# EAGLE design Blinky Buildings - Empire State Building (EAGLE 6.6.0)
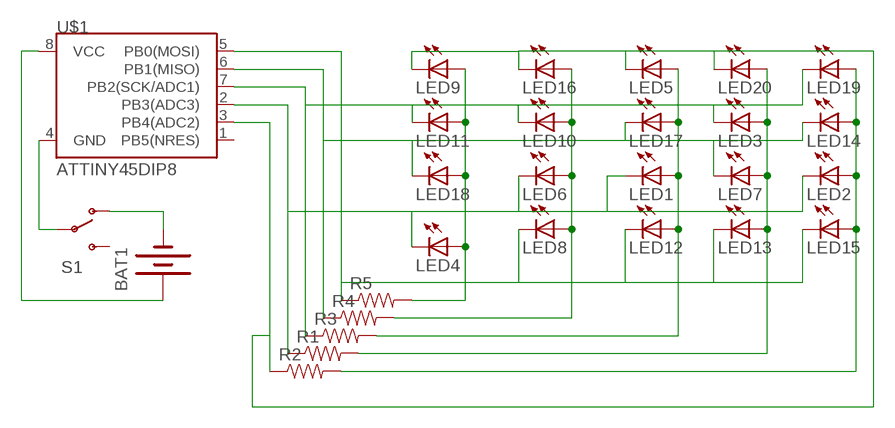
[diagram p0: schematic, sheet 1]

## Parts
BAT1  BATTERY20PTH  [BATTCOM_20MM_PTH]
LED1  LED3MM  [LED3MM]
LED2  LED3MM  [LED3MM]
LED3  LED3MM  [LED3MM]
LED4  LED3MM  [LED3MM]
LED5  LED3MM  [LED3MM]
LED6  LED3MM  [LED3MM]
LED7  LED3MM  [LED3MM]
LED8  LED3MM  [LED3MM]
LED9  LED3MM  [LED3MM]
LED10  LED3MM  [LED3MM]
LED11  LED3MM  [LED3MM]
LED12  LED3MM  [LED3MM]
LED13  LED3MM  [LED3MM]
LED14  LED3MM  [LED3MM]
LED15  LED3MM  [LED3MM]
LED16  LED3MM  [LED3MM]
LED17  LED3MM  [LED3MM]
LED18  LED3MM  [LED3MM]
LED19  LED3MM  [LED3MM]
LED20  LED3MM  [LED3MM]
R1  RESISTORAXIAL-0.3  [AXIAL-0.3]
R2  RESISTORAXIAL-0.3  [AXIAL-0.3]
R3  RESISTORAXIAL-0.3  [AXIAL-0.3]
R4  RESISTORAXIAL-0.3  [AXIAL-0.3]
R5  RESISTORAXIAL-0.3  [AXIAL-0.3]
S1  SWITCH-SPSTKIT  [SWITCH-SPDT_KIT]
U$1  ATTINY45DIP8  [DIP08]

## Nets
N$1: LED5.K(C) LED9.K(C) LED16.K(C) LED20.K(C) R2.P$1 U$1.3(PB4(ADC2))
N$2: LED1.K(C) LED2.K(C) LED4.K(C) LED6.K(C) R1.P$1 U$1.2(PB3(ADC3))
N$3: LED3.K(C) LED10.K(C) LED11.K(C) LED19.K(C) R3.P$1 U$1.7(PB2(SCK/ADC1))
N$4: LED7.K(C) LED14.K(C) LED17.K(C) LED18.K(C) R4.P$1 U$1.6(PB1(MISO))
N$5: LED8.K(C) LED12.K(C) LED13.K(C) LED15.K(C) R5.P$1 U$1.5(PB0(MOSI))
N$6: LED3.A LED7.A LED13.A LED20.A R1.P$2
N$7: LED4.A LED9.A LED11.A LED18.A R5.P$2
N$8: LED6.A LED8.A LED10.A LED16.A R4.P$2
N$9: LED1.A LED5.A LED12.A LED17.A R3.P$2
N$10: LED2.A LED14.A LED15.A LED19.A R2.P$2
N$11: S1.2(P) U$1.4(GND)
N$12: BAT1.1(+) U$1.8(VCC)
N$13: BAT1.2(-) S1.1(O)
Unconnected: S1.3(S) U$1.1(PB5(NRES))

## Library data of the parts
BAT1 = SparkFun:BATTERY: Battery Holders Various common sizes : AA, AAA, 20mm coin cell and 12mm coin cell.
LED1-LED20 = SparkFun:LED: LEDs Standard schematic elements and footprints for 5mm, 3mm, 1206, and 0603 sized LEDs. 5mm - Spark Fun Electronics SKU : COM-00529 (and others)
R1-R5 = SparkFun:RESISTOR: Resistor Basic schematic elements and footprints for 0603, 1206, and PTH resistors.
S1 = SparkFun:SWITCH-SPST: SPST Switch Simple slide switch. Spark Fun Electronics SKU : COM-00102
U$1 = SparkFun:ATTINY45: Atmel ATTiny45

## Board
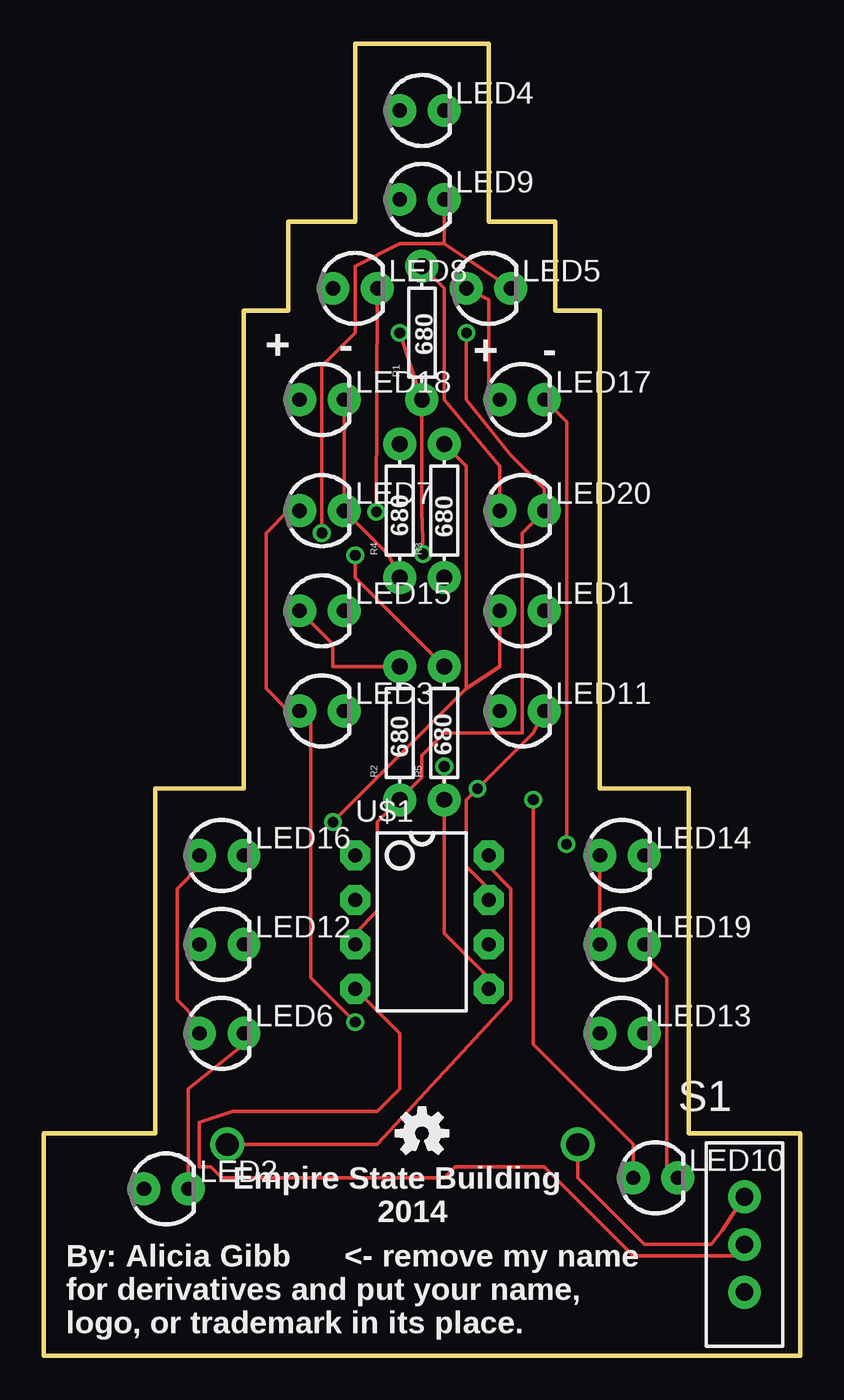
[diagram p1: board, top side]
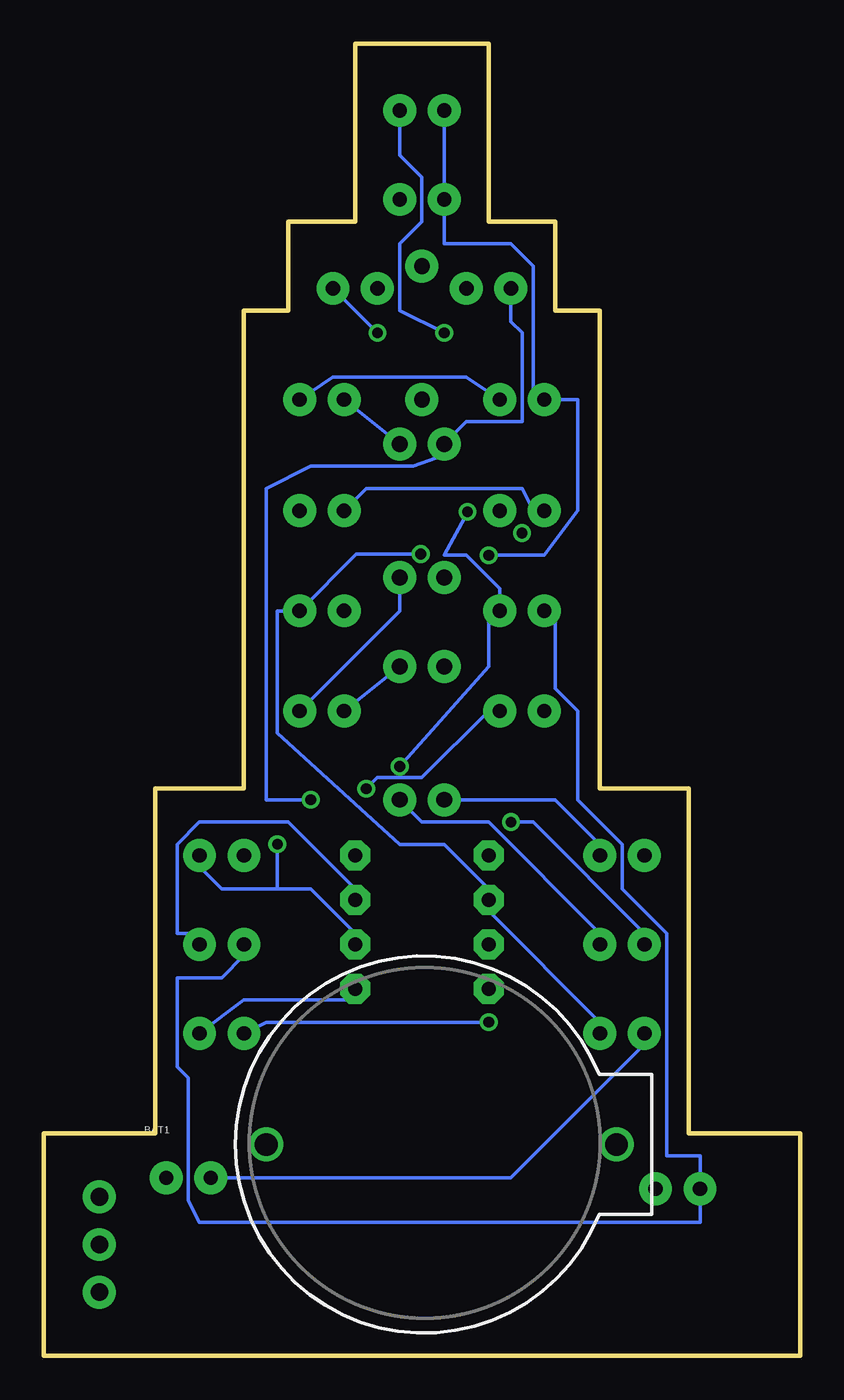
[diagram p2: board, bottom side, seen from below]

Size 43.18 x 74.93 mm. Coordinates in mm from the lower left corner, seen from the top.
Outline: 0,12.7 6.35,12.7 6.35,32.38 11.43,32.38 11.43,59.69 13.97,59.69 13.97,64.77 17.78,64.77 17.78,74.93 25.4,74.93 25.4,64.77 29.21,64.77 29.21,59.69 31.75,59.69 31.75,32.38 36.83,32.38 36.83,12.7 43.18,12.7 43.18,0 0,0 0,12.7
Copper layers (1*16): Top 0.035mm / dielectric 1.5mm / Bottom 0.035mm
Design rules "default": minimum track width 8mil, minimum drill 24mil, track to track 8mil, track to pad 8mil, pad to pad 8mil, via to via 8mil, smd to smd 8mil, copper to edge 40mil, drill to drill 8mil, minimum pad ring 10mil, minimum via ring 8mil, stop-mask expansion 4mil, vias tented up to drill 0mil, thermal gap 10mil

### Footprints (pad centres in the part's own frame; a part is rotated, then mirrored left to right if it is on the bottom)
BATTCOM_20MM_PTH = drill 1.3: 1 20,0; 2 0,0
LED3MM = drill 0.813 pad 1.88: A -1.27,0; K 1.27,0
AXIAL-0.3 = drill 0.9 pad 1.88: P$1 -3.81,0; P$2 3.81,0
SWITCH-SPDT_KIT = drill 1.016 pad 1.88: 1 0,2.718; 2 0,0; 3 0,-2.718
DIP08 = drill 0.813 pad 1.727 octagon: 1 -3.81,-3.81; 2 -1.27,-3.81; 3 1.27,-3.81; 4 3.81,-3.81; 5 3.81,3.81; 6 1.27,3.81; 7 -1.27,3.81; 8 -3.81,3.81

### Placement (x,y rotation side)
BAT1  30.48,12.06 0 bottom
LED1  27.3,42.54 0 top
LED2  6.99,9.53 0 top
LED3  15.87,36.83 0 top
LED4  21.59,71.12 0 top
LED5  25.4,60.96 0 top
LED6  10.16,18.42 0 top
LED7  15.87,48.26 0 top
LED8  17.78,60.96 0 top
LED9  21.59,66.04 0 top
LED10  34.92,10.16 0 top
LED11  27.3,36.83 0 top
LED12  10.16,23.5 0 top
LED13  33.02,18.42 0 top
LED14  33.02,28.57 0 top
LED15  15.87,42.54 0 top
LED16  10.16,28.57 0 top
LED17  27.3,54.61 0 top
LED18  15.87,54.61 0 top
LED19  33.02,23.5 0 top
LED20  27.3,48.26 0 top
R1  21.59,58.42 90 top
R2  20.32,35.56 90 top
R3  22.86,48.26 90 top
R4  20.32,48.26 90 top
R5  22.86,35.56 90 top
S1  40,6.35 0 top
U$1  21.59,24.77 270 top
U$2  [OSHW-LOGO-S]  21.59,12.7 0 top

### Tracks (layer width: path | path; a pad name or v marks a point on that pad's centre or on a via)
N$1  (via drill 0.61)
  Top 0.203: 22.86,63.5 LED5.K | 22.86,63.5 20.32,63.5 17.78,62.23 17.78,58.42 15.87,56.52 v15.87,46.99 | LED9.K 22.86,63.5 | U$1.3 17.78,24.13 19.05,25.4 19.05,30.48 R2.P$1 21.59,33.02 21.59,34.29 22.86,35.56 27.3,35.56 27.3,46.99 LED20.K 28.57,49.53 26.67,51.43 24.13,54.61 v24.13,58.42
  Bottom 0.203: R2.P$1 13.97,31.75 11.43,29.21 LED16.K | v24.13,58.42 LED5.K
N$2  (via drill 0.61)
  Top 0.203: v21.65,45.78 21.59,48.26 R1.P$1 v20.32,58.42 | LED2.K 8.25,15.24 11.43,17.78 LED6.K
  Bottom 0.203: LED4.K 22.86,68.58 21.59,67.31 21.59,64.77 22.86,63.5 22.86,59.69 v20.32,58.42 | LED6.K 11.43,19.05 17.78,25.4 U$1.2 17.78,26.67 20.32,29.21 22.86,29.21 29.85,35.56 29.85,42.54 LED1.K 25.34,45.78 v21.65,45.78
N$3  (via drill 0.61)
  Top 0.203: LED19.K 34.29,22.86 35.56,21.59 35.56,10.79 LED10.K | LED11.K 27.94,35.56 v24.76,32.38 24.13,31.75 24.13,27.94 25.4,26.67 U$1.7
  Bottom 0.203: U$1.7 25.4,26.67 29.21,30.48 34.29,30.48 35.56,29.21 35.56,24.13 34.29,24.13 LED19.K | R3.P$1 22.86,42.54 LED11.K | LED3.K 17.78,36.83 21.59,33.02 24.13,33.02 v24.76,32.38
N$4  (via drill 0.61)
  Top 0.203: R4.P$1 19.68,45.72 LED7.K LED18.K | v29.85,29.21 29.85,53.34 LED17.K
  Bottom 0.203: LED17.K 26.67,55.88 19.05,55.88 LED18.K | 29.85,26.67 33.02,26.67 34.29,27.94 LED14.K | 29.85,26.67 27.94,26.67 25.4,24.13 U$1.6 | v29.85,29.21 29.85,26.67
N$5  (via drill 0.61)
  Top 0.203: R5.P$1 22.86,24.13 25.4,21.59 U$1.5 | v18.99,48.2 LED8.K
  Top 0.254: R5.P$1 v22.86,33.66
  Bottom 0.203: R5.P$1 21.59,30.48 17.78,30.48 11.43,24.13 LED12.K | LED13.K 31.75,20.32 25.4,20.32 U$1.5 | v18.99,48.2 20.32,45.72 19.05,45.72 17.14,43.81 LED15.K 17.78,41.91 17.78,39.37 v22.86,33.66
N$6  (via drill 0.61)
  Top 0.203: R1.P$2 22.86,60.96 22.86,54.61 26.04,50.8 LED20.A | v17.78,19.05 15.24,21.59 15.24,36.83 LED3.A 13.97,36.83 12.7,38.1 12.7,46.99 13.97,48.26 LED7.A
  Bottom 0.203: LED7.A 15.24,48.26 15.87,49.53 24.76,49.53 LED20.A | LED13.A 30.48,19.05 v17.78,19.05
N$7  (via drill 0.61)
  Top 0.203: v17.78,45.72 17.78,44.45 R5.P$2
  Bottom 0.203: LED11.A R5.P$2 | LED4.A LED9.A 20.32,63.5 16.51,63.5 15.24,62.23 15.24,55.24 LED18.A 12.7,54.61 12.7,48.26 14.61,45.72 v17.78,45.72
N$8  (via drill 0.61)
  Top 0.203: LED6.A 8.89,19.05 7.62,20.32 7.62,26.67 8.89,27.94 LED16.A | LED10.A 33.66,12.06 27.94,17.78 v27.94,31.75
  Bottom 0.203: 34.29,10.16 LED10.A 16.51,10.16 8.89,17.78 LED6.A | v27.94,31.75 30.48,31.75 30.48,49.53 27.94,50.8 22.1,50.8 20.32,51.43 R4.P$2 19.05,53.34 15.87,53.34 15.87,58.42 16.51,59.05 LED8.A
N$9  (via drill 0.61)
  Top 0.203: LED5.A 25.4,60.33 25.4,55.24 LED17.A | 24.13,38.1 26.04,39.37 LED1.A | 24.13,38.1 v16.51,30.48 | R3.P$2 24.13,50.8 24.13,38.1
  Bottom 0.203: LED17.A R3.P$2 | v16.51,30.48 15.24,30.48 8.89,24.13 LED12.A
N$10
  Top 0.203: LED15.A 16.51,40.64 16.51,39.37 R2.P$2 | LED19.A LED14.A
  Bottom 0.203: LED19.A 31.75,22.86 33.02,21.59 35.56,21.59 35.56,16.51 34.92,15.87 34.92,8.89 34.29,7.62 5.71,7.62 LED2.A 5.71,11.43 7.62,11.43 7.62,24.13 10.16,26.67 10.16,29.21 12.7,31.75 12.7,36.83 13.97,38.1 13.97,41.91 LED15.A
N$11
  Top 0.203: U$1.4 20.32,18.42 20.32,15.24 19.05,13.97 10.79,13.97 8.89,13.33 8.89,10.79 9.53,10.79 10.16,10.16 22.86,10.16 23.5,10.79 28.57,10.79 33.66,5.71 39.37,5.71 S1.2
N$12
  Top 0.203: BAT1.1 19.05,12.06 26.67,20.32 26.67,26.67 25.4,27.94 U$1.8
N$13
  Top 0.203: BAT1.2 30.48,10.16 34.29,6.35 38.1,6.35 38.73,7.16 S1.1

### Text on the board
tPlace: + | - | 680 | + | - | 680 | 680 | 680 | 680 | Empire State Building | 2014 | By: Alicia Gibb | <- remove my name | for derivatives and put your name, | logo, or trademark in its place.